# EAGLE design komahub-v1.0 (EAGLE 7.7.0)
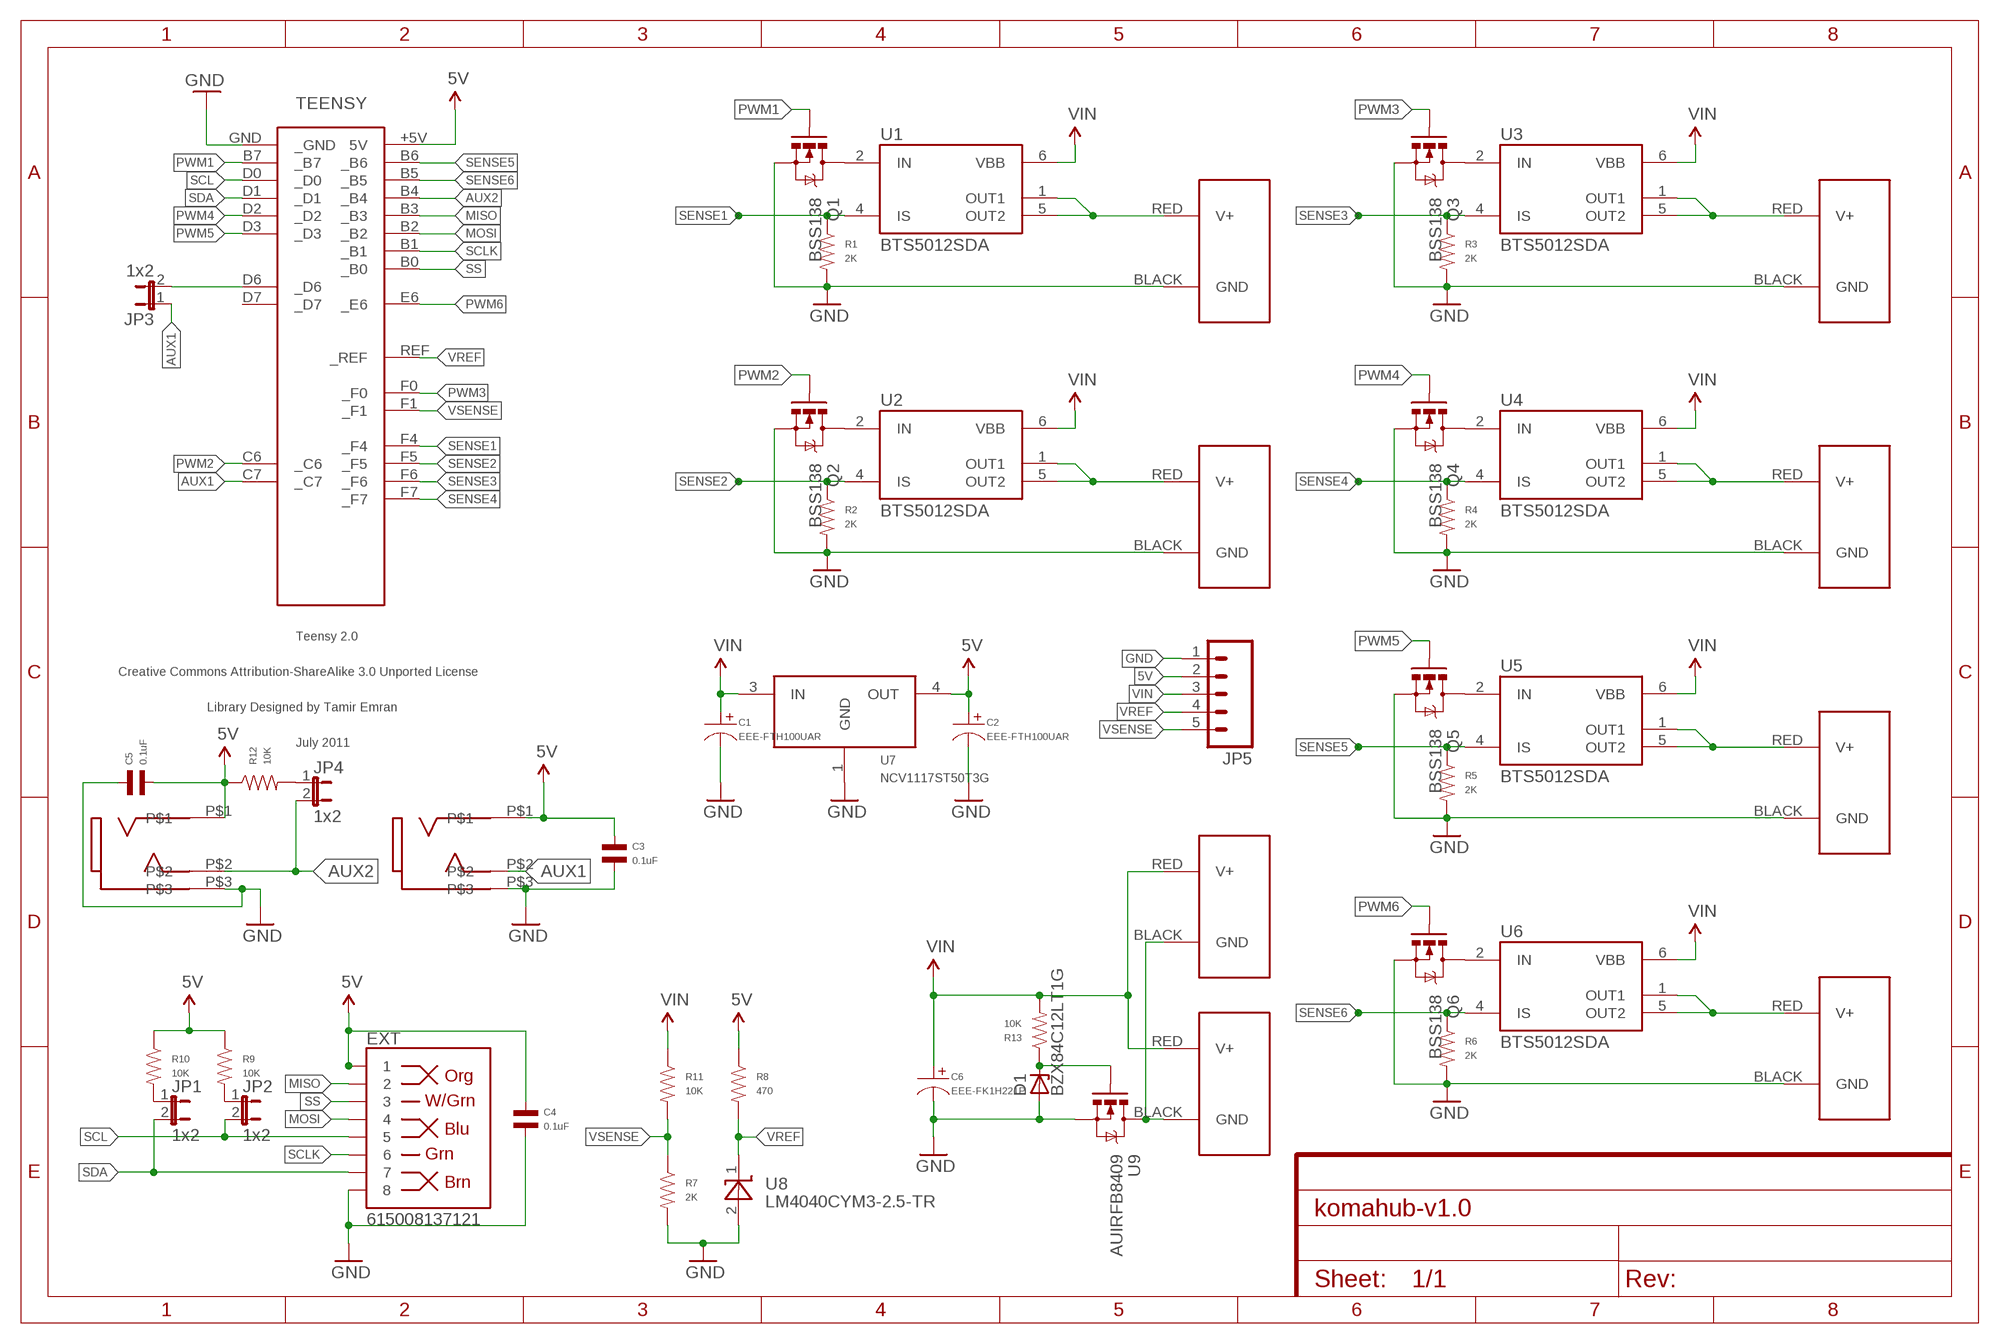
[diagram p0: schematic, sheet 1]
FRAME1 (FRAME-A4L): CNAME: KomaHub; CREVISION: 1.0; DESIGNER: Jari Saukkonen

## Parts
AUX1  35RASMT2BHNTRX  [35RASMT2BHNTRX]
AUX2  35RASMT2BHNTRX  [35RASMT2BHNTRX]
C1  EEE-FTH100UAR  CAPACITOR_P_4MM  [CP4MM]
C2  EEE-FTH100UAR  CAPACITOR_P_4MM  [CP4MM]
C3  0.1uF  CAPACITOR_NP_0603  [C0603]
C4  0.1uF  CAPACITOR_NP_0603  [C0603]
C5  0.1uF  CAPACITOR_NP_0603  [C0603]
C6  EEE-FK1H221P  CAPACITOR_P_10MM  [CP10MM]
D1  BZX84C12LT1G  ZENER-DIODESOT23  [SOT23]
EXT  615008137121  RJ45-8PTH  [RJ45-8]
J1  POWERPOLE_POWER25A_HORIZONTAL_G11  [POWERPOLE_PAIR_25A_HORIZ_G11]
J2  POWERPOLE_POWER25A_HORIZONTAL_G11  [POWERPOLE_PAIR_25A_HORIZ_G11]
J3  POWERPOLE_POWER25A_HORIZONTAL_G12  [POWERPOLE_PAIR_25A_HORIZ_G12]
J4  POWERPOLE_POWER25A_HORIZONTAL_G12  [POWERPOLE_PAIR_25A_HORIZ_G12]
J5  POWERPOLE_POWER25A_HORIZONTAL_G12  [POWERPOLE_PAIR_25A_HORIZ_G12]
J6  POWERPOLE_POWER25A_HORIZONTAL_G11  [POWERPOLE_PAIR_25A_HORIZ_G11]
J7  POWERPOLE_POWER25A_HORIZONTAL_G11  [POWERPOLE_PAIR_25A_HORIZ_G11]
J9  POWERPOLE_POWER25A_HORIZONTAL_G12  [POWERPOLE_PAIR_25A_HORIZ_G12]
JP1  1x2  JUMPER-2PTH  [1X02]
JP2  1x2  JUMPER-2PTH  [1X02]
JP3  1x2  JUMPER-2PTH  [1X02]
JP4  1x2  JUMPER-2PTH  [1X02]
JP5  M05PTH  [1X05]
Q1  BSS138  MOSFET-NCHANNELAO3404A  [SOT23-3]
Q2  BSS138  MOSFET-NCHANNELAO3404A  [SOT23-3]
Q3  BSS138  MOSFET-NCHANNELAO3404A  [SOT23-3]
Q4  BSS138  MOSFET-NCHANNELAO3404A  [SOT23-3]
Q5  BSS138  MOSFET-NCHANNELAO3404A  [SOT23-3]
Q6  BSS138  MOSFET-NCHANNELAO3404A  [SOT23-3]
R1  2K  RESISTOR_0603  [R0603]
R2  2K  RESISTOR_0603  [R0603]
R3  2K  RESISTOR_0603  [R0603]
R4  2K  RESISTOR_0603  [R0603]
R5  2K  RESISTOR_0603  [R0603]
R6  2K  RESISTOR_0603  [R0603]
R7  2K  RESISTOR_0603  [R0603]
R8  470  RESISTOR_0603  [R0603]
R9  10K  RESISTOR_0603  [R0603]
R10  10K  RESISTOR_0603  [R0603]
R11  10K  RESISTOR_0603  [R0603]
R12  10K  RESISTOR_0603  [R0603]
R13  10K  RESISTOR_0603  [R0603]
TEENSY  TEENSY-SIMPLE  [TEENSY-SIMPLE]
U1  BTS5012SDA  BTS5016SDA  [TO114P998X235-5_6N]
U2  BTS5012SDA  BTS5016SDA  [TO114P998X235-5_6N]
U3  BTS5012SDA  BTS5016SDA  [TO114P998X235-5_6N]
U4  BTS5012SDA  BTS5016SDA  [TO114P998X235-5_6N]
U5  BTS5012SDA  BTS5016SDA  [TO114P998X235-5_6N]
U6  BTS5012SDA  BTS5016SDA  [TO114P998X235-5_6N]
U7  NCV1117ST50T3G  NCV1117  [DPAK]
U8  LM4040CYM3-2.5-TR  LM4040CYM3-2.5  [SOT-23]
U9  AUIRFB8409  [TO220AV]

## Nets
5V: AUX1.P$1 AUX2.P$1 C2.P$1 C3.P$1 C4.P$1 C5.P$2 EXT.1 JP5.2 R8.P$1 R9.P$1 R10.P$1 R12.P$1 TEENSY.+5V(5V) U7.4(OUT)
AUX1: AUX1.P$2 JP3.1 TEENSY.C7(_C7)
AUX2: AUX2.P$2 JP4.2 TEENSY.B4(_B4)
GND: AUX1.P$3 AUX2.P$3 C1.P$2 C2.P$2 C3.P$2 C4.P$2 C5.P$1 C6.P$2 D1.1(A) EXT.8 J1.BLACK(GND) J2.BLACK(GND) J3.BLACK(GND) J5.BLACK(GND) J7.BLACK(GND) J9.BLACK(GND) JP5.1 Q1.2(S) Q2.2(S) Q3.2(S) Q4.2(S) Q5.2(S) Q6.2(S) R1.P$2 R2.P$2 R3.P$2 R4.P$2 R5.P$2 R6.P$2 R7.P$2 TEENSY.GND(_GND) U7.1(GND) U8.2(A) U9.3(S)
GNDIN: J4.BLACK(GND) J6.BLACK(GND) U9.2(D)
MISO: EXT.2 TEENSY.B3(_B3)
MOSI: EXT.4 TEENSY.B2(_B2)
N$1: JP3.2 TEENSY.D6(_D6)
N$2: JP2.1 R9.P$2
N$3: JP4.1 R12.P$2
N$4: JP1.1 R10.P$2
N$6: D1.3(C) R13.P$1 U9.1(G)
PWM1: Q1.1(G) TEENSY.B7(_B7)
PWM2: Q2.1(G) TEENSY.C6(_C6)
PWM3: Q3.1(G) TEENSY.F0(_F0)
PWM4: Q4.1(G) TEENSY.D2(_D2)
PWM5: Q5.1(G) TEENSY.D3(_D3)
PWM6: Q6.1(G) TEENSY.E6(_E6)
PWMT1: Q1.3(D) U1.2(IN)
PWMT2: Q2.3(D) U2.2(IN)
PWMT3: Q3.3(D) U3.2(IN)
PWMT4: Q4.3(D) U4.2(IN)
PWMT5: Q5.3(D) U5.2(IN)
PWMT6: Q6.3(D) U6.2(IN)
PWR1: J2.RED(V+) U1.1(OUT1) U1.5(OUT2)
PWR2: J3.RED(V+) U2.1(OUT1) U2.5(OUT2)
PWR3: J1.RED(V+) U3.1(OUT1) U3.5(OUT2)
PWR4: J5.RED(V+) U4.1(OUT1) U4.5(OUT2)
PWR5: J7.RED(V+) U5.1(OUT1) U5.5(OUT2)
PWR6: J9.RED(V+) U6.1(OUT1) U6.5(OUT2)
SCL: EXT.5 JP2.2 TEENSY.D0(_D0)
SCLK: EXT.6 TEENSY.B1(_B1)
SDA: EXT.7 JP1.2 TEENSY.D1(_D1)
SENSE1: R1.P$1 TEENSY.F4(_F4) U1.4(IS)
SENSE2: R2.P$1 TEENSY.F5(_F5) U2.4(IS)
SENSE3: R3.P$1 TEENSY.F6(_F6) U3.4(IS)
SENSE4: R4.P$1 TEENSY.F7(_F7) U4.4(IS)
SENSE5: R5.P$1 TEENSY.B6(_B6) U5.4(IS)
SENSE6: R6.P$1 TEENSY.B5(_B5) U6.4(IS)
SS: EXT.3 TEENSY.B0(_B0)
VIN: C1.P$1 C6.P$1 J4.RED(V+) J6.RED(V+) JP5.3 R11.P$1 R13.P$2 U1.6(VBB) U2.6(VBB) U3.6(VBB) U4.6(VBB) U5.6(VBB) U6.6(VBB) U7.3(IN)
VREF: JP5.4 R8.P$2 TEENSY.REF(_REF) U8.1(C)
VSENSE: JP5.5 R7.P$1 R11.P$2 TEENSY.F1(_F1)
Unconnected: TEENSY.D7(_D7)

## Library data of the parts
AUX1 AUX2 = alvarop-lib:35RASMT2BHNTRX
C1 C2 = MF_Passives:CAPACITOR_P: Library: MF_Passives Description: Device for Polarized Capacitors. Manufacture part number (MPN), Voltage Rating, and Tolerance can be added via Attributes. Check https://factory.macrofab.com/parts for the house parts list.; MPN: MF-CAP-4MM-10uF; POPULATE: 1
C3-C5 = MF_Passives:CAPACITOR_NP: Library: MF_Passives Description: Device for Non-Polarized Capacitors. Manufacture part number (MPN) can be added via Attributes. Check https://factory.macrofab.com/parts for the house parts list.; POPULATE: 1
C6 = MF_Passives:CAPACITOR_P: Library: MF_Passives Description: Device for Polarized Capacitors. Manufacture part number (MPN), Voltage Rating, and Tolerance can be added via Attributes. Check https://factory.macrofab.com/parts for the house parts list.; MPN: EEE-FT1H221AP; POPULATE: 1
D1 = diode:ZENER-DIODE: Z-Diode
EXT = SparkFun-Connectors:RJ45-8: RJ45 Jack Simple RJ45, 8-pin connection - connector for common Cat5, Cat5e, and Cat6 Ethernet cables. Footprint not yet proven in production. Connector sku is PRT-00643; Breakout PCB sku is BOB-00716.; PROD_ID: CONN-08506; VALUE: RJ45
J1-J7 J9 = powerpoles:POWERPOLE_POWER: Anderson Powerpole Power Connector using ameteur radio standard layout
JP1-JP4 = SparkFun-Retired:JUMPER-2: Jumper Basic 0.1" spaced jumper. Use with breakaway headers.
JP5 = SparkFun-Connectors:M05: Header 5 Standard 5-pin 0.1" header. Use with straight break away headers (SKU : PRT-00116), right angle break away headers (PRT-00553), swiss pins (PRT-00743), machine pins (PRT-00117), and female headers (PRT-00115). Molex polarized connector foot print use with SKU : PRT-08230 with associated crimp pins and housings.
Q1-Q6 = SparkFun-DiscreteSemi:MOSFET-NCHANNEL: Common NMOSFET Parts MFG P/N Store ID Prod ID FDD8780 TRANS-09984 SI7820DN TRANS-11055 FDS6630A IC-08089 2N7002PW TRANS-11151 FQP30N06L COM-10213 TRANS-10060 BSS123LT1G TRANS-08345 BSS138 TRANS-00830 BS170 2N7000; PROD_ID: TRAN-12988
R1-R7 = MF_Passives:RESISTOR: Library: MF_Passives Description: Device for Resistors. Manufacture part number (MPN), Voltage, Tolerance, and Wattage Rating can be added via Attributes. Check https://factory.macrofab.com/parts for the house parts list.; MPN: MF-RES-0603-2K; POPULATE: 1
R8 = MF_Passives:RESISTOR: Library: MF_Passives Description: Device for Resistors. Manufacture part number (MPN), Voltage, Tolerance, and Wattage Rating can be added via Attributes. Check https://factory.macrofab.com/parts for the house parts list.; MPN: MF-RES-0603-470; POPULATE: 1
R9-R13 = MF_Passives:RESISTOR: Library: MF_Passives Description: Device for Resistors. Manufacture part number (MPN), Voltage, Tolerance, and Wattage Rating can be added via Attributes. Check https://factory.macrofab.com/parts for the house parts list.; MPN: MF-RES-0603-10K; POPULATE: 1
TEENSY = teensy:TEENSY-SIMPLE: Teensy 2.0 Original Design by Clint Fisher Modified Design by Tamir Emran Licensed Under Creative Commons Attribution-ShareAlike 3.0 Unported (CC BY-SA 3.0)
U1-U6 = BTS5016SDA:BTS5016SDA: BTS5016SDA Smart High-Side Power Switch TO114P998X235-5_6N
U7 = on-semiconductor:NCV1117
U8 = GuShH:LM4040
U9 = components:AUIRFB8409; MPN: AUIRFB8409

## Board
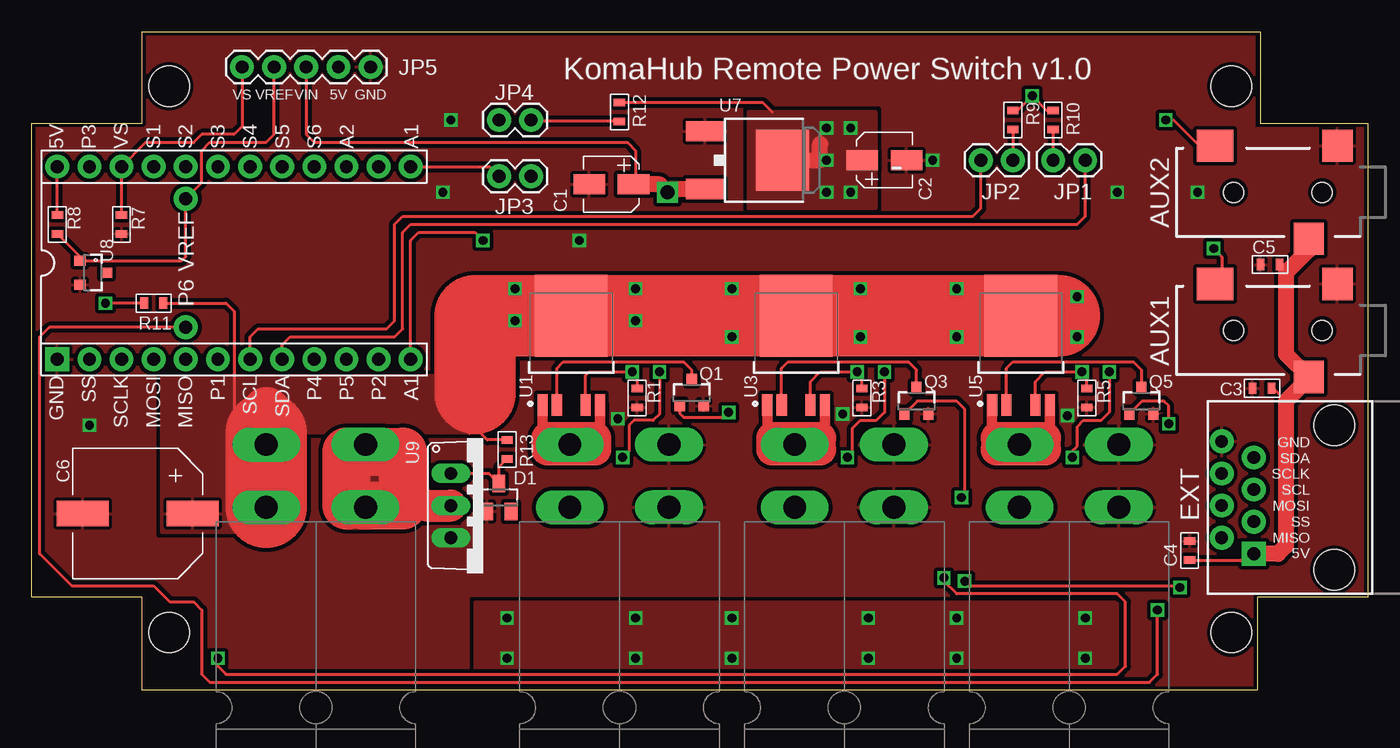
[diagram p1: board, top side]
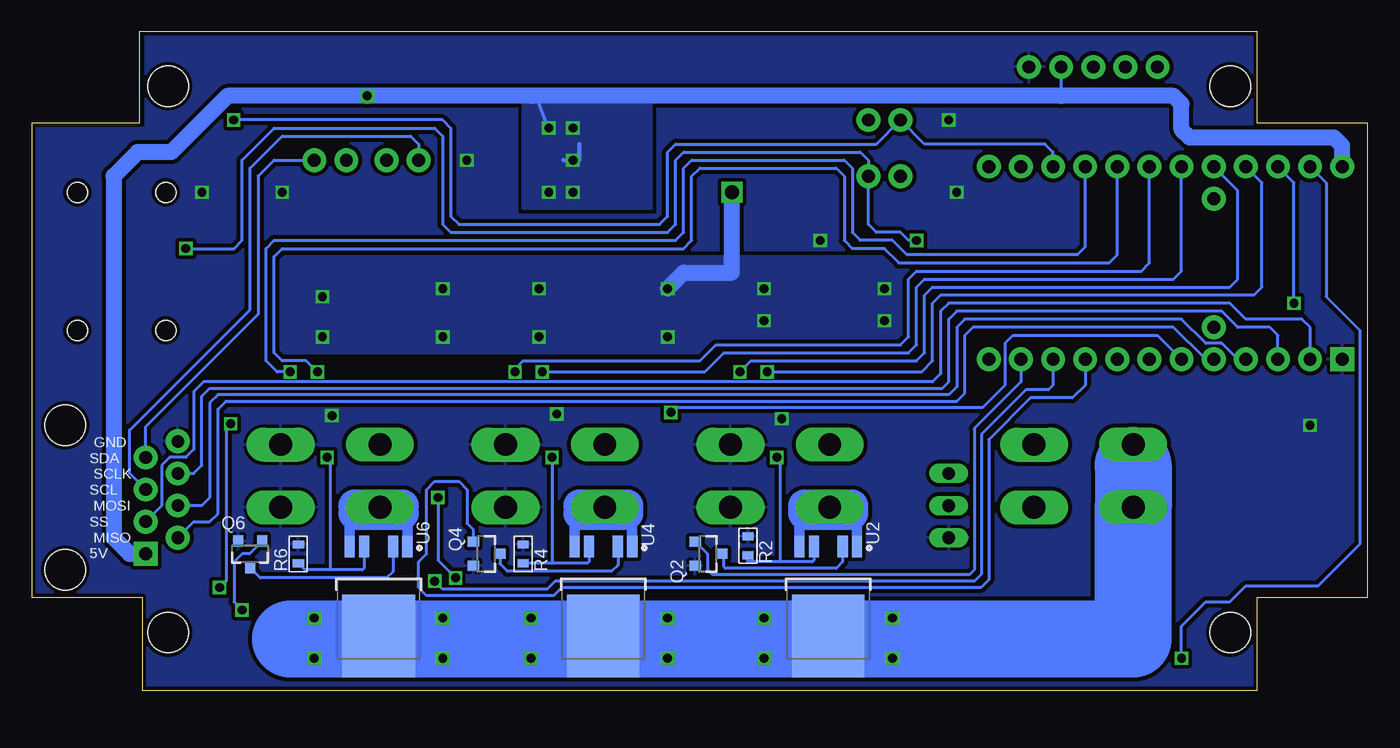
[diagram p2: board, bottom side, seen from below]

Size 105.66 x 52.07 mm. Coordinates in mm from the lower left corner, seen from the top.
Outline: 8.76,0 8.76,7.37 0,7.37 0,44.83 8.76,44.83 8.76,52.07 97.16,52.07 97.16,44.83 105.66,44.83 105.66,7.37 96.9,7.37 96.9,0 8.76,0
Copper layers (1*16): Top 0.035mm / dielectric 1.5mm / Bottom 0.035mm
Design rules "MF_Standard_2_Layer *": minimum track width 5mil, minimum drill 12mil, track to track 5mil, track to pad 5mil, pad to pad 5mil, via to via 5mil, smd to smd 0mil, copper to edge 10mil, drill to drill 10mil, minimum pad ring 6mil, minimum via ring 6mil, stop-mask expansion 2mil, vias tented up to drill 45mil, thermal gap 10mil
Holes 3.2 mm at 94.87,47.75 94.87,4.57 10.87,47.75 10.87,4.57

### Footprints (pad centres in the part's own frame; a part is rotated, then mirrored left to right if it is on the bottom)
35RASMT2BHNTRX = smd 2.4 x 2.55: P$1 -2.44,3.675; P$3 -4.7,-3.675 | smd 2.9 x 2.55: P$2 4.96,-3.675 | hole 1.6: -3.5,0; 3.5,0
CP4MM = smd 1.6 x 2.5: P$1 0,-1.75; P$2 0,1.75
C0603 = smd 0.6 x 0.9: P$1 -0.75,0; P$2 0.75,0
CP10MM = smd 2 x 4.1: P$1 0,-4.35; P$2 0,4.35
SOT23 = smd 1 x 1.4: 1 -0.95,-1.1; 2 0.95,-1.1; 3 0,1.1
RJ45-8 = drill 1 pad 1.88 square: 1 -4.445,6.35 | drill 1 pad 1.88: 2 -3.175,8.89; 3 -1.905,6.35; 4 -0.635,8.89; 5 0.635,6.35; 6 1.905,8.89; 7 3.175,6.35; 8 4.445,8.89 | hole 3.2: -5.715,0; 5.715,0
POWERPOLE_PAIR_25A_HORIZ_G11 = drill 1.8 long: BLACK -3.925,-6.096; RED 3.925,-6.096
POWERPOLE_PAIR_25A_HORIZ_G12 = drill 1.8 long: BLACK -3.925,-1.13; RED 3.925,-1.13
1X02 = drill 1.016 pad 1.88: 1 0,0; 2 2.54,0
1X05 = drill 1.016 pad 1.88: 1 0,0; 2 2.54,0; 3 5.08,0; 4 7.62,0; 5 10.16,0
SOT23-3 = smd 0.8 x 0.9: 1 -0.95,-1; 2 0.95,-1; 3 0,1.1
R0603 = smd 0.6 x 0.9: P$1 -0.75,0; P$2 0.75,0
TEENSY-SIMPLE = drill 1.016 pad 1.88: +5V -13.97,7.62; B0 -11.43,-7.62; B1 -8.89,-7.62; B2 -6.35,-7.62; B3 -3.81,-7.62; B4 8.89,7.62; B5 6.35,7.62; B6 3.81,7.62; B7 -1.27,-7.62; C6 11.43,-7.62; C7 13.97,-7.62; D0 1.27,-7.62; D1 3.81,-7.62; D2 6.35,-7.62; D3 8.89,-7.62; D6 13.97,7.62; D7 11.43,7.62; E6 -3.81,-5.08; F0 -11.43,7.62; F1 -8.89,7.62; F4 -6.35,7.62; F5 -3.81,7.62; F6 -1.27,7.62; F7 1.27,7.62; REF -3.81,5.08 | drill 1.016 pad 1.88 square: GND -13.97,-7.62
TO114P998X235-5_6N = smd 1.7 x 0.8: 1 -4.75,2.28; 2 -4.75,1.14; 4 -4.75,-1.14; 5 -4.75,-2.28 | smd 6.5 x 5.75: 6 2.3,0
DPAK = smd 1.6 x 3: 1 -2.28,-2.77; 3 2.28,-2.77 | smd 4.826 x 4.191: 4 0,3.366
SOT-23 = smd 0.8 x 0.9: 1 -0.95,-1; 2 0.95,-1; 3 0,1.1
TO220AV = drill 1.016 long: 1 -2.54,-2.54; 2 0,-2.54; 3 2.54,-2.54

### Placement (x,y rotation side)
AUX1  98.55,28.45 180 top
AUX2  98.55,39.37 180 top
C1  45.85,40.01 90 top
C2  67.44,41.91 270 top
C3  97.28,23.88 180 top
C4  91.57,11.05 90 top
C5  97.92,33.66 0 top
C6  8.38,13.97 90 top
D1  36.96,15.24 0 top
EXT  103,15.24 90 top
J1  64.26,13.34 180 top
J2  46.48,13.34 180 top
J3  46.48,13.34 180 top
J4  22.48,13.34 180 top
J5  64.26,13.34 180 top
J6  22.48,13.34 180 top
J7  82.04,13.34 180 top
J9  82.04,13.34 180 top
JP1  80.77,41.91 0 top
JP2  77.6,41.91 180 top
JP3  39.5,40.64 180 top
JP4  39.5,45.09 180 top
JP5  26.8,49.28 180 top
Q1  52.2,23.5 0 top
Q2  52.2,10.8 270 bottom
Q3  69.98,22.86 0 top
Q4  69.72,10.8 270 bottom
Q5  87.76,22.86 0 top
Q6  88.39,10.8 180 bottom
R1  47.88,23.11 270 top
R2  49.02,11.43 90 bottom
R3  65.66,23.11 270 top
R4  66.8,10.8 90 bottom
R5  83.44,23.11 270 top
R6  84.58,10.8 90 bottom
R7  7.11,36.83 270 top
R8  2.03,36.83 270 top
R9  77.6,45.09 270 top
R10  80.77,45.09 270 top
R11  9.65,30.61 180 top
R12  46.48,45.72 270 top
R13  37.59,19.05 90 top
TEENSY  16,33.78 0 top
U1  42.67,27.3 90 top
U2  42.67,6.6 270 bottom
U3  60.45,27.3 90 top
U4  60.45,6.6 270 bottom
U5  78.23,27.3 90 top
U6  78.23,6.6 270 bottom
U7  56.01,41.91 270 top
U8  4.83,33.02 270 top
U9  35.69,14.61 270 top

### Tracks (layer width: path | path; a pad name or v marks a point on that pad's centre or on a via)
5V  (via drill 0.7)
  Top 0.254: R8.P$1 TEENSY.+5V | R10.P$1 80.28,45.84 v79.12,46.99 77.97,45.84 R9.P$1 | R12.P$1 57.8,46.47 58.55,45.72 | C5.P$2 98.67,33.54 99.19,33.02 | C4.P$1 96.15,10.3 EXT.1 | 99.19,22.86 98.13,23.91 98.13,24.03 98.03,23.93 C3.P$1
  Top 0.305: 62.36,43.81 62.36,43.18
  Top 1.27: U7.4 62.36,41.91 62.36,43.18 | EXT.1 98.55,10.8 99.19,11.43 99.19,22.86 100.99,24.66 AUX1.P$1 99.19,26.58 99.19,33.02 100.99,34.83 AUX2.P$1
  Bottom 0.254: v64.77,44.45 65.53,46.36 66.17,46.99 | JP5.2 24.26,46.99
  Bottom 0.305: 63.63,41.91 v62.86,41.91 62.36,41.91 62.36,43.18
  Bottom 1.27: EXT.1 97.92,10.8 99.19,12.07 99.19,40.64 97.28,42.55 94.61,42.55 90.17,46.99 v79.12,46.99 66.17,46.99 24.26,46.99 15.37,46.99 14.73,46.36 14.73,44.32 14.1,43.69 2.67,43.69 2.03,43.05 TEENSY.+5V
  other vias: 64.77,39.37 62.86,39.37 62.86,44.45
  pour Top (no thermals): 56.64,45.72 56.64,38.1 66.8,38.1 66.8,45.72
  pour Bottom (no thermals): 56.64,47.5 66.8,47.5 66.8,38.1 56.64,38.1
AUX1  (via drill 0.7)
  Top 0.254: TEENSY.C7 29.97,35.56 30.61,36.2 35.05,36.2 v35.69,35.56 | v93.47,34.93 94.11,34.29 94.11,32.77 AUX1.P$2
  Bottom 0.254: v93.47,34.93 89.66,34.93 89.03,35.56 89.03,41.91 86.49,44.45 73.79,44.45 73.15,43.81 73.15,36.83 72.52,36.2 55.37,36.2 54.74,36.83 54.74,41.91 54.1,42.55 40.13,42.55 39.5,41.91 JP3.1 39.5,36.83 38.86,36.2 36.96,36.2 36.32,35.56 v35.69,35.56
AUX2  (via drill 0.7)
  Top 0.254: v89.69,45.09 90.3,45.09 92.2,43.18 93.46,43.18 AUX2.P$2
  Bottom 0.254: v89.69,45.09 73.15,45.09 72.52,44.45 72.52,37.47 71.88,36.83 56.01,36.83 55.37,37.47 55.37,42.55 54.74,43.18 38.86,43.18 JP4.2 35.05,43.18 25.53,43.18 24.89,42.55 TEENSY.B4
GND  (via drill 0.7)
  Top 0.254: U7.1 53.24,44.22 53.47,44.45
  other vias: 33.15,45.09 85.85,39.37 71.25,41.91 46.35,21.46 64.14,21.84 81.92,21.72 92.2,39.37 4.57,20.96 43.31,35.56 32.51,39.37
  pour Top (isolate 0.305, rank 2): 0.13,44.45 9.02,44.45 9.02,45.72 9.02,52.07 96.65,52.07 96.65,44.45 105.54,44.45 105.54,7.62 96.65,7.62 96.65,0 9.02,0 9.02,7.62 0.13,7.62
  pour Bottom (isolate 0.305, rank 2): 0.13,44.45 9.02,44.45 9.02,52.07 96.65,52.07 96.65,44.45 105.54,44.45 105.54,7.62 96.65,7.62 96.65,0 9.02,0 9.02,7.62 0.13,7.62
  pour Top (no thermals): 31.24,12.95 35.05,12.95 35.05,10.8 31.24,10.8
GNDIN
  Top 0.254: 26.16,14.61 26.16,18.03 J6.BLACK | J4.BLACK 31.1,14.46 31.24,14.61
  Top 2.54: 31.24,14.61 U9.2 | J4.BLACK 25.03,14.61
  Top 3.81: 25.03,14.61 24.89,14.61 24.89,18.87 29.34,18.87 29.34,14.61 26.16,14.61
  pour Top: 25.53,17.78 25.53,15.88 28.07,15.88 28.07,17.78
  pour Top: 26.8,12.7 24.89,12.7 24.89,14.61 26.8,14.61
MISO
  Bottom 0.254: TEENSY.B3 12.83,26.16 15.37,28.7 31.24,28.7 31.88,28.07 31.88,23.5 32.51,22.86 90.3,22.86 90.93,22.23 90.93,13.97 91.57,13.34 92.84,13.34 EXT.2
MOSI
  Bottom 0.254: TEENSY.B2 10.29,26.16 11.56,27.43 12.83,27.43 14.73,29.34 31.88,29.34 32.51,28.7 32.51,24 33.15,23.37 90.93,23.37 91.57,22.73 91.57,15.24 92.2,14.61 EXT.4
N$1
  Top 0.254: TEENSY.D6 36.2,41.4 JP3.2
N$2
  Top 0.254: R9.P$2 JP2.1
N$3
  Top 0.254: R12.P$2 39.61,44.97 JP4.1
N$4
  Top 0.254: R10.P$2 JP1.1
N$6
  Top 0.254: U9.1 36.15,17.14 D1.3 36.96,17.66 R13.P$1
PWM1  (via drill 0.7)
  Top 0.254: v55.12,21.97 54.74,21.59 51.56,21.59 51.25,21.91 Q1.1
  Bottom 0.254: TEENSY.B7 16.64,28.07 28.07,28.07 28.7,27.43 28.7,24.13 30.48,22.35 54.74,22.35 v55.12,21.97
PWM2
  Bottom 0.254: TEENSY.C6 27.43,24.38 31.12,20.7 31.12,9.52 31.5,9.14 51.82,9.14 52.2,9.52 52.2,10.75 Q2.1
PWM3  (via drill 0.7)
  Top 0.254: v73.53,15.24 73.79,15.49 73.79,22.23 73.15,22.86 70.03,22.86 Q3.1 | v14.73,2.54 14.73,1.91 15.37,1.27 85.85,1.27 86.49,1.91 86.49,6.99 85.85,7.62 73.15,7.62 72.14,8.64 v72.14,8.89
  Bottom 0.254: TEENSY.F0 3.3,40.13 3.3,31.12 0.64,28.45 0.64,11.56 3.94,8.25 9.65,8.25 10.92,6.99 12.83,6.99 14.73,5.08 v14.73,2.54 | v73.53,15.24 73.53,10.29 v72.14,8.89
PWM4
  Bottom 0.254: TEENSY.D2 22.35,24.13 23.37,23.11 26.67,23.11 29.97,19.81 29.97,8.76 30.61,8.13 63.75,8.13 64.39,7.49 74.42,7.49 75.06,8.13 75.06,10.16 74.42,10.8 74.42,15.88 73.79,16.51 71.88,16.51 71.25,15.88 71.25,13.21 70.72,12.68 Q4.1
PWM5  (via drill 0.7)
  Top 0.254: 86.85,21.86 Q5.1 87.81,22.86 89.53,22.86 89.92,22.48 v89.92,21.08 | v73.79,8.64 74.17,8.25 90.68,8.25 v90.8,8.13
  Bottom 0.254: TEENSY.D3 24.89,24.13 25.27,23.75 27.05,23.75 30.56,20.24 30.56,9.2 31.12,8.64 64.26,8.64 64.9,8 73.15,8 v73.79,8.64 | v89.92,21.08 90.3,20.7 90.3,8.64 v90.8,8.13
PWM6  (via drill 0.7)
  Top 0.254: TEENSY.E6 1.4,28.7 0.64,27.94 0.64,10.8 3.17,8.25 9.65,8.25 10.92,6.99 12.83,6.99 13.46,6.35 13.46,1.27 14.1,0.63 88.39,0.63 89.03,1.27 v89.03,6.35
  Bottom 0.254: Q6.1 88.44,10.8 89.03,10.8 89.66,10.16 89.66,6.99 v89.03,6.35
PWMT1
  Top 0.254: U1.2 41.53,25.45 42.04,25.96 51.56,25.96 52.2,25.32 Q1.3
PWMT2
  Bottom 0.254: U2.2 41.53,10.16 42.04,9.65 50.8,9.65 50.93,9.78 50.93,10.62 Q2.3
PWMT3
  Top 0.254: U3.2 59.31,25.45 59.82,25.96 69.34,25.96 69.98,25.32 Q3.3
PWMT4
  Bottom 0.254: U4.2 59.31,9.9 59.82,9.4 68.03,9.4 68.62,9.99 Q4.3
PWMT5
  Top 0.254: U5.2 77.09,25.45 77.6,25.96 87.12,25.96 87.76,25.32 Q5.3 87.59,24.13
PWMT6
  Bottom 0.254: U6.2 77.09,9.39 77.6,8.89 87.59,8.89 Q6.3
PWR1
  Top 0.254: 40.77,19.05 42.32,18.03 J2.RED
  Top 0.813: U1.5 44.95,20.06 44.58,19.94 | U1.1 40.39,20.06 40.77,19.94
  Top 2.54: 40.77,19.05 44.58,19.05 44.58,19.94 40.77,19.94 40.77,19.05
PWR2
  Bottom 0.813: U2.5 44.95,13.6 44.58,13.97 | U2.1 40.39,13.6 40.77,13.97
  Bottom 2.54: J3.RED 44.58,13.97 | 44.58,13.97 40.77,13.97 40.77,14.61 44.58,14.61 44.58,13.97
PWR3
  Top 0.813: U3.1 58.17,19.43 58.55,19.05 | U3.5 62.73,20.06 62.36,19.94
  Top 2.54: J1.RED 58.91,19.04 58.55,19.05 | 58.55,19.05 62.36,19.05 62.36,19.94 58.55,19.94 58.55,19.05
PWR4
  Bottom 0.813: U4.1 58.17,13.6 58.55,13.97 | U4.5 62.73,13.6 62.36,13.97
  Bottom 2.54: J5.RED 58.69,14.46 58.55,14.61 | 58.55,14.61 62.36,14.61 62.36,13.97 58.55,13.97 58.55,14.61
PWR5
  Top 0.813: U5.1 75.95,19.43 76.33,19.05 | U5.5 80.51,20.06 80.14,19.94
  Top 2.54: J7.RED 76.82,19.16 76.33,19.05 | 76.33,19.05 80.14,19.05 80.14,19.94 76.33,19.94 76.33,19.05
PWR6
  Bottom 0.813: U6.1 75.95,13.6 76.33,13.97 | U6.5 80.51,13.6 80.14,13.97
  Bottom 2.54: J9.RED 76.47,14.46 76.33,14.61 | 76.33,14.61 80.14,14.61 80.14,13.97 76.33,13.97 76.33,14.61
SCL
  Top 0.254: TEENSY.D0 17.27,27.94 17.91,28.57 28.07,28.57 28.7,29.21 28.7,36.83 29.34,37.47 74.42,37.47 75.06,38.1 JP2.2
  Bottom 0.254: EXT.5 97.92,17.14 97.92,20.57 88.39,30.1 88.39,41.27 85.85,43.81 75.69,43.81 75.06,43.18 JP2.2
SCLK
  Bottom 0.254: TEENSY.B1 7.11,28.07 7.75,28.7 10.29,28.7 11.56,29.97 32.51,29.97 33.15,29.34 33.15,24.38 33.66,23.88 91.57,23.88 92.2,23.24 92.2,17.78 92.84,17.14 EXT.6
SDA
  Top 0.254: TEENSY.D1 19.81,27.3 20.45,27.94 28.7,27.94 29.34,28.57 29.34,36.2 29.97,36.83 82.68,36.83 83.31,37.47 JP1.2
  Bottom 0.254: EXT.7 96.65,20.83 87.76,29.72 87.76,40.64 86.49,41.91 JP1.2
SENSE1  (via drill 0.7)
  Top 0.254: R1.P$1 47.88,24.79 v47.5,25.17 44.07,25.17 43.81,24.91 U1.4
  Bottom 0.254: TEENSY.F4 8.38,40.13 8.38,31.88 9.02,31.24 33.78,31.24 34.42,30.61 34.42,26.04 35.28,25.17 v47.5,25.17
SENSE2  (via drill 0.7)
  Top 0.254: v49.66,25.17 49.66,21.84 49.15,21.34 47.62,21.34 47.24,20.96 47.24,18.92 v46.74,18.41
  Bottom 0.254: TEENSY.F5 10.29,39.5 10.29,32.51 10.92,31.88 34.42,31.88 35.05,31.24 35.05,26.67 35.69,26.04 48.79,26.04 v49.66,25.17 | 43.81,10.93 U2.4 43.81,10.29 43.94,10.16 46.48,10.16 | v46.74,18.41 46.48,18.16 46.48,10.16 | 46.48,10.16 48.5,10.16 | 48.5,10.16 R2.P$1 49.02,10.16 48.5,10.16
SENSE3  (via drill 0.7)
  Top 0.254: U3.4 61.59,24.41 62.36,25.17 v65.28,25.17 65.66,24.79 R3.P$1
  Bottom 0.254: TEENSY.F6 14.73,33.15 15.37,32.51 35.05,32.51 35.69,31.88 35.69,27.3 36.32,26.67 50.93,26.67 52.43,25.17 v65.28,25.17
SENSE4  (via drill 0.7)
  Top 0.254: v67.44,25.17 67.44,21.97 66.8,21.34 65.53,21.34 64.9,20.7 64.9,18.8 v64.52,18.41
  Bottom 0.254: TEENSY.F7 17.27,33.78 17.91,33.15 35.69,33.15 36.32,32.51 36.32,27.94 36.96,27.3 51.56,27.3 52.83,26.04 66.8,26.04 67.44,25.4 v67.44,25.17 | U4.4 61.59,10.16 61.72,10.03 64.52,10.03 | 64.52,10.03 66.79,10.03 R4.P$1 | v64.52,18.41 64.52,10.03
SENSE5  (via drill 0.7)
  Top 0.254: v83.06,25.17 83.17,25.17 | U5.4 79.37,24.41 80.14,25.17 v83.06,25.17 | R5.P$1 83.44,24.79 v83.06,25.17
  Bottom 0.254: TEENSY.B6 19.81,34.42 20.45,33.78 37.08,33.78 38.23,34.93 40.77,34.93 41.4,35.56 41.4,40.64 42.04,41.27 52.83,41.27 53.47,40.64 53.47,35.56 54.1,34.93 85.85,34.93 86.49,34.29 86.49,26.67 85.85,26.04 83.95,26.04 83.08,25.17 v83.06,25.17
SENSE6  (via drill 0.7)
  Top 0.254: v85.22,25.17 85.22,21.97 84.58,21.34 83.19,21.34 82.68,20.83 82.68,19.3 82.3,18.92 v82.3,18.41
  Bottom 0.254: TEENSY.B5 22.35,35.05 22.99,34.42 36.45,34.42 37.59,35.56 40.13,35.56 40.77,36.2 40.77,41.27 41.4,41.91 53.47,41.91 54.1,41.27 54.1,36.2 54.74,35.56 86.49,35.56 87.12,34.93 87.12,26.04 86.26,25.17 v85.22,25.17 | U6.4 79.37,9.66 79.5,9.52 82.04,9.52 | 82.04,9.52 84.06,9.52 R6.P$1 | 82.04,9.52 82.04,18.03 82.3,18.29 v82.3,18.41
SS
  Bottom 0.254: TEENSY.B0 4.57,28.7 5.21,29.34 9.65,29.34 10.92,30.61 33.15,30.61 33.78,29.97 33.78,25.02 34.42,24.38 92.08,24.38 92.84,23.62 92.84,19.05 93.47,18.41 94.74,18.41 95.38,17.78 95.38,14.61 EXT.3
VIN  (via drill 0.7, 1.1)
  Top 0.254: 50.04,39.62 v50.29,39.37 | JP5.3 21.72,43.94 22.35,43.31 47.12,43.31 47.75,42.67 47.75,40.26 47.6,40.11 C1.P$1 | 53.23,30.88 v55.37,31.75 | 17.4,20.32 16,21.72 16,29.97 15.37,30.61 R11.P$1 | 34.59,20.37 34.59,20.32 35.05,20.78 | 50.93,39.37 52.98,39.37 U7.3 | v82.68,27.94 81.41,29.48 81.28,29.61 | 35.05,23.5 35.05,21.59 | 35.05,21.59 35.05,20.78 | 34.59,22.1 34.59,22.05 35.05,21.59 | R13.P$2 36.03,19.8 35.05,20.78
  Top 0.813: 18.54,20.32 17.4,20.32
  Top 1.27: U7.3 50.55,39.63 v50.29,39.37 49.66,40.01 C1.P$1
  Top 3.81: 18.54,20.32 18.55,20.32 18.55,22.1 | J4.RED 18.06,13.97
  Top 6.452: 81.28,29.61 U5.6 U3.6 U1.6 35.05,29.61 35.05,23.5 | 18.54,20.32 18.54,18.28 J6.RED J4.RED
  Bottom 0.254: v83.31,2.54 85.22,4.05 | U6.6 74.56,4.3 v73.15,5.72 | U4.6 56.78,4.3 v55.37,5.72 | U2.6 39,4.3 v37.59,5.72 | v66.17,2.54 v73.15,2.54
  Bottom 1.27: v55.37,31.75 54.1,33.02 50.29,33.02 v50.29,39.37
  Bottom 6.096: 18.55,17.78 J4.RED 18.55,4.05 85.22,4.05
  other vias: 82.68,31.12 73.15,31.75 73.15,27.94 65.53,31.75 65.53,27.94 55.37,27.94 47.75,29.21 47.75,31.75 83.31,5.72 66.17,5.72 55.37,2.54 47.75,5.72 47.75,2.54 37.59,2.54 38.23,31.75 38.23,29.21
  pour Bottom (isolate 0.305): 36.32,34.29 86.49,34.29 86.49,26.67 36.32,26.67
  pour Top (isolate 0.305): 35.05,6.99 85.85,6.99 85.85,1.02 35.05,1.02
  pour Top (isolate 0.305): 10.29,12.45 10.29,24.77 21.08,24.77 20.45,12.45
  pour Top (isolate 0.305): 14.73,24.89 35.69,24.89 35.69,20.32 14.73,20.32
VREF
  Top 0.254: JP5.4 19.18,43.94 18.54,43.31 14.1,43.31 13.46,42.67 13.46,40.13 TEENSY.REF 12.19,34.29 11.87,33.97 U8.1 3.83,34.29 R8.P$2
VSENSE  (via drill 0.7)
  Top 0.254: R7.P$1 TEENSY.F1 9.02,43.31 12.83,43.31 13.46,43.94 16,43.94 16.64,44.58 JP5.5 | R11.P$2 v5.84,30.61
  Bottom 0.254: v5.84,30.61 5.84,40.13 TEENSY.F1

### Text on the board
tPlace: KomaHub Remote Power Switch v1.0 | VS | VREF | VIN | 5V | GND | 5V / P3 / VS / S1 / S2 / S3 / S4 / S5 / S6 / A2 / / A1 | VREF | P6 | GND / SS / SCLK / MOSI / MISO / P1 / SCL / SDA / P4 / P5 / P2 / A1 | EXT | GND / SDA / SCLK / SCL / MOSI / SS / MISO / 5V
bPlace: GND / SDA / SCLK / SCL / MOSI / SS / MISO / 5V